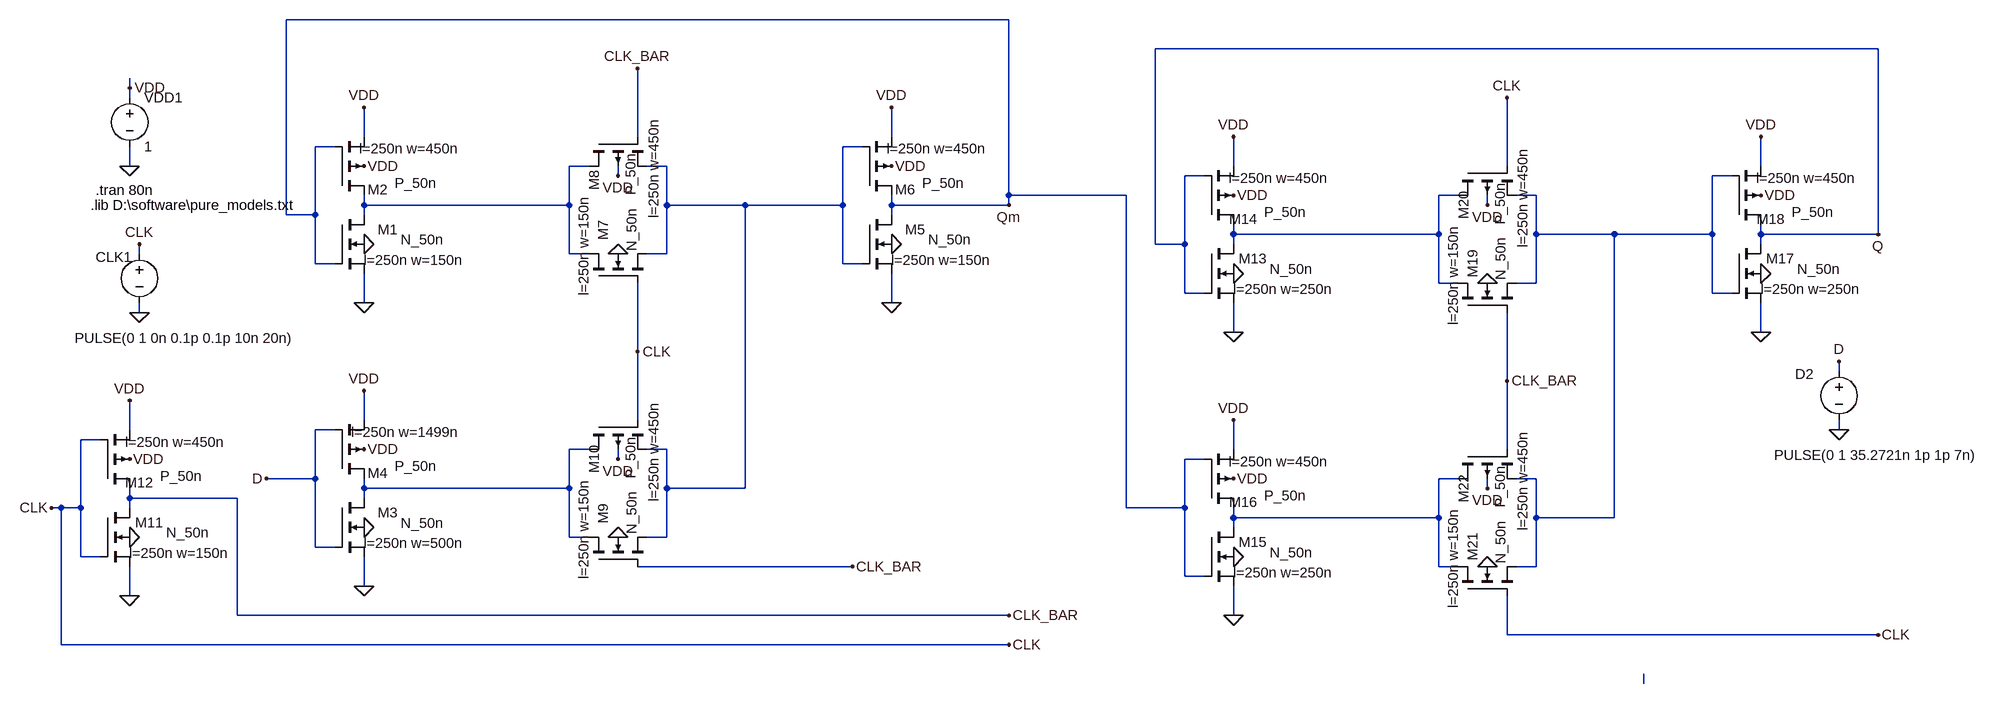
[diagram p0: schematic lab6(combine negative and positive latch).asc]
lab6(combine negative and positive latch).asc, the LTspice schematic file:
Version 4
SHEET 1 2808 772
WIRE 992 -320 -192 -320
WIRE 2416 -272 1232 -272
WIRE -448 -208 -448 -224
WIRE -448 -192 -448 -208
WIRE -64 -128 -64 -176
WIRE 384 -128 384 -240
WIRE 800 -128 800 -176
WIRE -112 -112 -144 -112
WIRE 752 -112 720 -112
WIRE -448 -80 -448 -112
WIRE 304 -80 272 -80
WIRE 432 -80 400 -80
WIRE 1360 -80 1360 -128
WIRE 1808 -80 1808 -192
WIRE 2224 -80 2224 -128
WIRE 352 -64 352 -80
WIRE 1312 -64 1280 -64
WIRE 2176 -64 2144 -64
WIRE 992 -32 992 -320
WIRE 1184 -32 992 -32
WIRE 1728 -32 1696 -32
WIRE 1856 -32 1824 -32
WIRE -64 -16 -64 -32
WIRE 272 -16 272 -80
WIRE 272 -16 -64 -16
WIRE 432 -16 432 -80
WIRE 560 -16 432 -16
WIRE 720 -16 720 -112
WIRE 720 -16 560 -16
WIRE 800 -16 800 -32
WIRE 992 -16 992 -32
WIRE 992 -16 800 -16
WIRE 1776 -16 1776 -32
WIRE -192 0 -192 -320
WIRE -144 0 -144 -112
WIRE -144 0 -192 0
WIRE -64 0 -64 -16
WIRE 800 0 800 -16
WIRE 1360 32 1360 16
WIRE 1696 32 1696 -32
WIRE 1696 32 1360 32
WIRE 1856 32 1856 -32
WIRE 1984 32 1856 32
WIRE 2144 32 2144 -64
WIRE 2144 32 1984 32
WIRE 2224 32 2224 16
WIRE 2416 32 2416 -272
WIRE 2416 32 2224 32
WIRE 1232 48 1232 -272
WIRE 1280 48 1280 -64
WIRE 1280 48 1232 48
WIRE 1360 48 1360 32
WIRE 2224 48 2224 32
WIRE -432 64 -432 48
WIRE 272 64 272 -16
WIRE 304 64 272 64
WIRE 432 64 432 -16
WIRE 432 64 400 64
WIRE -144 80 -144 0
WIRE -112 80 -144 80
WIRE 720 80 720 -16
WIRE 752 80 720 80
WIRE 1696 112 1696 32
WIRE 1728 112 1696 112
WIRE 1856 112 1856 32
WIRE 1856 112 1824 112
WIRE 1280 128 1280 48
WIRE 1312 128 1280 128
WIRE 2144 128 2144 32
WIRE 2176 128 2144 128
WIRE -64 144 -64 96
WIRE 800 144 800 96
WIRE -432 160 -432 144
WIRE 1360 192 1360 144
WIRE 2224 192 2224 144
WIRE 384 224 384 112
WIRE 2352 256 2352 240
WIRE 1808 272 1808 160
WIRE -64 336 -64 288
WIRE 384 336 384 224
WIRE -448 352 -448 304
WIRE -112 352 -144 352
WIRE 2352 352 2352 336
WIRE -496 368 -528 368
WIRE 304 384 272 384
WIRE 432 384 400 384
WIRE 1360 384 1360 336
WIRE 1808 384 1808 272
WIRE 352 400 352 384
WIRE 1312 400 1280 400
WIRE -144 432 -144 352
WIRE -144 432 -224 432
WIRE 1728 432 1696 432
WIRE 1856 432 1824 432
WIRE -64 448 -64 432
WIRE 272 448 272 384
WIRE 272 448 -64 448
WIRE 432 448 432 384
WIRE 560 448 560 -16
WIRE 560 448 432 448
WIRE 1776 448 1776 432
WIRE -448 464 -448 448
WIRE -272 464 -448 464
WIRE -64 464 -64 448
WIRE -560 480 -576 480
WIRE -528 480 -528 368
WIRE -528 480 -560 480
WIRE -448 480 -448 464
WIRE 1184 480 1184 -32
WIRE 1280 480 1280 400
WIRE 1280 480 1184 480
WIRE 1360 496 1360 480
WIRE 1696 496 1696 432
WIRE 1696 496 1360 496
WIRE 1856 496 1856 432
WIRE 1984 496 1984 32
WIRE 1984 496 1856 496
WIRE 1360 512 1360 496
WIRE 272 528 272 448
WIRE 304 528 272 528
WIRE 432 528 432 448
WIRE 432 528 400 528
WIRE -144 544 -144 432
WIRE -112 544 -144 544
WIRE -528 560 -528 480
WIRE -496 560 -528 560
WIRE 736 576 384 576
WIRE 1696 576 1696 496
WIRE 1728 576 1696 576
WIRE 1856 576 1856 496
WIRE 1856 576 1824 576
WIRE 1280 592 1280 480
WIRE 1312 592 1280 592
WIRE -64 608 -64 560
WIRE -448 624 -448 576
WIRE -272 656 -272 464
WIRE 992 656 -272 656
WIRE 1360 656 1360 608
WIRE 1808 688 1808 624
WIRE 2416 688 1808 688
WIRE -560 704 -560 480
WIRE 992 704 -560 704
WIRE 2032 768 2032 752
FLAG -432 160 0
FLAG -432 48 CLK
FLAG -448 -80 0
FLAG -448 -208 VDD
FLAG -64 48 0
FLAG -64 -80 VDD
FLAG -64 144 0
FLAG -64 -176 VDD
FLAG -64 512 0
FLAG -64 384 VDD
FLAG -64 608 0
FLAG -64 288 VDD
FLAG 800 48 0
FLAG 800 -80 VDD
FLAG 800 144 0
FLAG 800 -176 VDD
FLAG 352 64 0
FLAG 352 -64 VDD
FLAG 352 528 0
FLAG 352 400 VDD
FLAG -448 528 0
FLAG -448 400 VDD
FLAG -448 624 0
FLAG -448 304 VDD
FLAG -576 480 CLK
FLAG 992 704 CLK
FLAG 992 656 CLK_BAR
FLAG 384 -240 CLK_BAR
FLAG 384 224 CLK
FLAG -224 432 D
FLAG 992 -16 Qm
FLAG 736 576 CLK_BAR
FLAG 1360 96 0
FLAG 1360 -32 VDD
FLAG 1360 192 0
FLAG 1360 -128 VDD
FLAG 1360 560 0
FLAG 1360 432 VDD
FLAG 1360 656 0
FLAG 1360 336 VDD
FLAG 2224 96 0
FLAG 2224 -32 VDD
FLAG 2224 192 0
FLAG 2224 -128 VDD
FLAG 1776 112 0
FLAG 1776 -16 VDD
FLAG 1776 576 0
FLAG 1776 448 VDD
FLAG 1808 -192 CLK
FLAG 1808 272 CLK_BAR
FLAG 2416 32 Q
FLAG 2416 688 CLK
FLAG 2352 352 0
FLAG 2352 240 D
SYMBOL voltage -432 48 R0
WINDOW 0 -72 21 Left 2
WINDOW 3 -106 154 Left 2
WINDOW 123 0 0 Left 2
WINDOW 39 0 0 Left 2
SYMATTR InstName CLK1
SYMATTR Value PULSE(0 1 0n 0.1p 0.1p 10n 20n)
SYMBOL voltage -448 -208 R0
WINDOW 123 0 0 Left 2
WINDOW 39 0 0 Left 2
SYMATTR InstName VDD1
SYMATTR Value 1
SYMBOL nmos4 -112 0 R0
WINDOW 0 104 24 Right 2
WINDOW 3 179 41 Right 2
WINDOW 123 213 74 Right 2
SYMATTR InstName M1
SYMATTR Value N_50n
SYMATTR Value2 l=250n w=150n
SYMBOL pmos4 -112 -32 M180
WINDOW 0 88 9 Right 2
WINDOW 3 168 20 Right 2
WINDOW 123 206 76 Right 2
SYMATTR InstName M2
SYMATTR Value P_50n
SYMATTR Value2 l=250n w=450n
SYMBOL nmos4 -112 464 R0
WINDOW 0 104 24 Right 2
WINDOW 3 179 41 Right 2
WINDOW 123 213 74 Right 2
SYMATTR InstName M3
SYMATTR Value N_50n
SYMATTR Value2 l=250n w=500n
SYMBOL pmos4 -112 432 M180
WINDOW 0 88 9 Right 2
WINDOW 3 168 20 Right 2
WINDOW 123 206 76 Right 2
SYMATTR InstName M4
SYMATTR Value P_50n
SYMATTR Value2 l=250n w=1499n
SYMBOL nmos4 752 0 R0
WINDOW 0 104 24 Right 2
WINDOW 3 179 41 Right 2
WINDOW 123 213 74 Right 2
SYMATTR InstName M5
SYMATTR Value N_50n
SYMATTR Value2 l=250n w=150n
SYMBOL pmos4 752 -32 M180
WINDOW 0 88 9 Right 2
WINDOW 3 168 20 Right 2
WINDOW 123 206 76 Right 2
SYMATTR InstName M6
SYMATTR Value P_50n
SYMATTR Value2 l=250n w=450n
SYMBOL nmos4 304 112 R270
WINDOW 0 104 24 Right 2
WINDOW 3 123 70 Right 2
WINDOW 123 145 -8 Right 2
SYMATTR InstName M7
SYMATTR Value N_50n
SYMATTR Value2 l=250n w=150n
SYMBOL pmos4 304 -128 M90
WINDOW 0 88 9 Right 2
WINDOW 3 96 69 Right 2
WINDOW 123 134 106 Right 2
SYMATTR InstName M8
SYMATTR Value P_50n
SYMATTR Value2 l=250n w=450n
SYMBOL nmos4 304 576 R270
WINDOW 0 104 24 Right 2
WINDOW 3 123 70 Right 2
WINDOW 123 145 -8 Right 2
SYMATTR InstName M9
SYMATTR Value N_50n
SYMATTR Value2 l=250n w=150n
SYMBOL pmos4 304 336 M90
WINDOW 0 88 9 Right 2
WINDOW 3 96 69 Right 2
WINDOW 123 134 106 Right 2
SYMATTR InstName M10
SYMATTR Value P_50n
SYMATTR Value2 l=250n w=450n
SYMBOL nmos4 -496 480 R0
WINDOW 0 104 24 Right 2
WINDOW 3 179 41 Right 2
WINDOW 123 213 74 Right 2
SYMATTR InstName M11
SYMATTR Value N_50n
SYMATTR Value2 l=250n w=150n
SYMBOL pmos4 -496 448 M180
WINDOW 0 88 9 Right 2
WINDOW 3 168 20 Right 2
WINDOW 123 206 76 Right 2
SYMATTR InstName M12
SYMATTR Value P_50n
SYMATTR Value2 l=250n w=450n
SYMBOL nmos4 1312 48 R0
WINDOW 0 104 24 Right 2
WINDOW 3 179 41 Right 2
WINDOW 123 213 74 Right 2
SYMATTR InstName M13
SYMATTR Value N_50n
SYMATTR Value2 l=250n w=250n
SYMBOL pmos4 1312 16 M180
WINDOW 0 88 9 Right 2
WINDOW 3 168 20 Right 2
WINDOW 123 206 76 Right 2
SYMATTR InstName M14
SYMATTR Value P_50n
SYMATTR Value2 l=250n w=450n
SYMBOL nmos4 1312 512 R0
WINDOW 0 104 24 Right 2
WINDOW 3 179 41 Right 2
WINDOW 123 213 74 Right 2
SYMATTR InstName M15
SYMATTR Value N_50n
SYMATTR Value2 l=250n w=250n
SYMBOL pmos4 1312 480 M180
WINDOW 0 88 9 Right 2
WINDOW 3 168 20 Right 2
WINDOW 123 206 76 Right 2
SYMATTR InstName M16
SYMATTR Value P_50n
SYMATTR Value2 l=250n w=450n
SYMBOL nmos4 2176 48 R0
WINDOW 0 104 24 Right 2
WINDOW 3 179 41 Right 2
WINDOW 123 213 74 Right 2
SYMATTR InstName M17
SYMATTR Value N_50n
SYMATTR Value2 l=250n w=250n
SYMBOL pmos4 2176 16 M180
WINDOW 0 88 9 Right 2
WINDOW 3 168 20 Right 2
WINDOW 123 206 76 Right 2
SYMATTR InstName M18
SYMATTR Value P_50n
SYMATTR Value2 l=250n w=450n
SYMBOL nmos4 1728 160 R270
WINDOW 0 104 24 Right 2
WINDOW 3 123 70 Right 2
WINDOW 123 145 -8 Right 2
SYMATTR InstName M19
SYMATTR Value N_50n
SYMATTR Value2 l=250n w=150n
SYMBOL pmos4 1728 -80 M90
WINDOW 0 88 9 Right 2
WINDOW 3 96 69 Right 2
WINDOW 123 134 106 Right 2
SYMATTR InstName M20
SYMATTR Value P_50n
SYMATTR Value2 l=250n w=450n
SYMBOL nmos4 1728 624 R270
WINDOW 0 104 24 Right 2
WINDOW 3 123 70 Right 2
WINDOW 123 145 -8 Right 2
SYMATTR InstName M21
SYMATTR Value N_50n
SYMATTR Value2 l=250n w=150n
SYMBOL pmos4 1728 384 M90
WINDOW 0 88 9 Right 2
WINDOW 3 96 69 Right 2
WINDOW 123 134 106 Right 2
SYMATTR InstName M22
SYMATTR Value P_50n
SYMATTR Value2 l=250n w=450n
SYMBOL voltage 2352 240 R0
WINDOW 0 -72 21 Left 2
WINDOW 3 -106 154 Left 2
WINDOW 123 0 0 Left 2
WINDOW 39 0 0 Left 2
SYMATTR InstName D2
SYMATTR Value PULSE(0 1 35.2721n 1p 1p 7n)
TEXT -504 -40 Left 2 !.tran 80n
TEXT -512 -16 Left 2 !.lib D:\\software\\pure_models.txt

The netlist it stands for:
* lab6(combine negative and positive latch).asc
V§CLK1 CLK 0 PULSE(0 1 0n 0.1p 0.1p 10n 20n)
VDD1 VDD 0 1
M1 N002 Qm 0 0 N_50n l=250n w=150n
M2 N002 Qm VDD VDD P_50n l=250n w=450n
M3 N005 D 0 0 N_50n l=250n w=500n
M4 N005 D VDD VDD P_50n l=250n w=1499n
M5 Qm N001 0 0 N_50n l=250n w=150n
M6 Qm N001 VDD VDD P_50n l=250n w=450n
M7 N002 CLK N001 0 N_50n l=250n w=150n
M8 N002 CLK_BAR N001 VDD P_50n l=250n w=450n
M9 N005 CLK_BAR N001 0 N_50n l=250n w=150n
M10 N005 CLK N001 VDD P_50n l=250n w=450n
M11 CLK_BAR CLK 0 0 N_50n l=250n w=150n
M12 CLK_BAR CLK VDD VDD P_50n l=250n w=450n
M13 N004 Q 0 0 N_50n l=250n w=250n
M14 N004 Q VDD VDD P_50n l=250n w=450n
M15 N006 Qm 0 0 N_50n l=250n w=250n
M16 N006 Qm VDD VDD P_50n l=250n w=450n
M17 Q N003 0 0 N_50n l=250n w=250n
M18 Q N003 VDD VDD P_50n l=250n w=450n
M19 N004 CLK_BAR N003 0 N_50n l=250n w=150n
M20 N004 CLK N003 VDD P_50n l=250n w=450n
M21 N006 CLK N003 0 N_50n l=250n w=150n
M22 N006 CLK_BAR N003 VDD P_50n l=250n w=450n
V§D2 D 0 PULSE(0 1 35.2721n 1p 1p 7n)
.model NMOS NMOS
.model PMOS PMOS
.lib standard.mos
.tran 80n
.lib D:\software\pure_models.txt
.backanno
.end